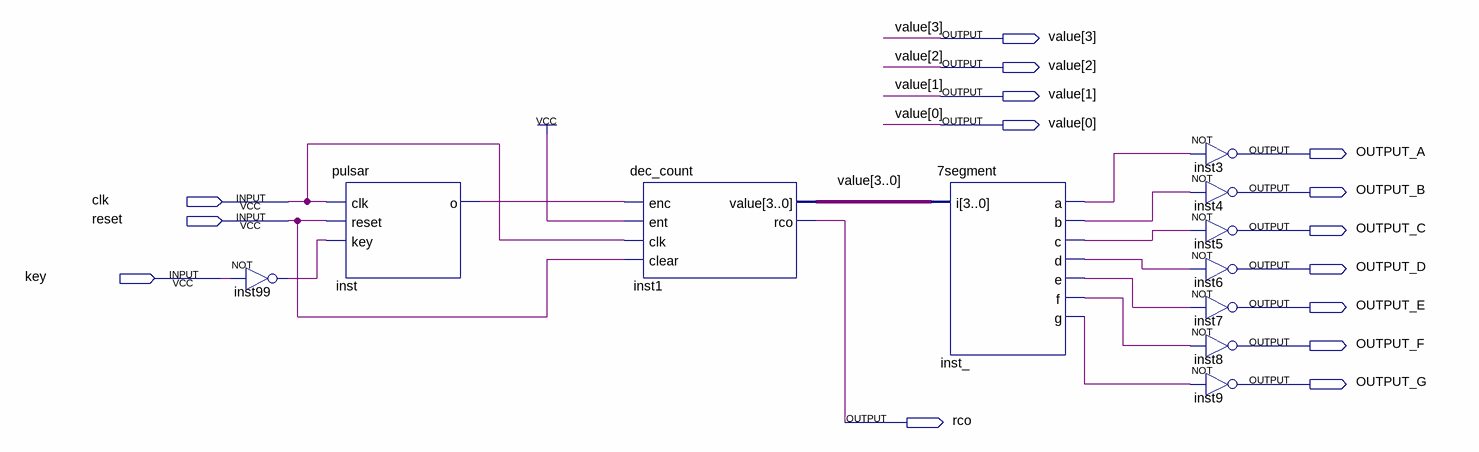
[diagram p0: schematic sheet]
// Quartus schematic YL_pushcounter.bdf as structural Verilog: 11 symbols, 15 pins
module YL_pushcounter (
  input  clk,
  input  reset,
  input  key,
  output [3:0] value,
  output OUTPUT_A,
  output OUTPUT_B,
  output OUTPUT_C,
  output OUTPUT_D,
  output OUTPUT_E,
  output OUTPUT_F,
  output OUTPUT_G,
  output rco
);

  wire inst99_out, inst__a, inst__b, inst__c, inst__d, inst__e, inst__f, inst__g, inst_o;

  not inst99 (inst99_out, key);
  pulsar inst (.clk(clk), .reset(reset), .key(inst99_out), .o(inst_o));
  dec_count inst1 (.enc(inst_o), .ent(1'b1), .clk(clk), .clear(reset), .value(value), .rco(rco));
  \7segment  inst_ (
    .i(value), .a(inst__a), .b(inst__b), .c(inst__c), .d(inst__d), .e(inst__e), .f(inst__f), .g(inst__g));
  not inst3 (OUTPUT_A, inst__a);
  not inst4 (OUTPUT_B, inst__b);
  not inst5 (OUTPUT_C, inst__c);
  not inst6 (OUTPUT_D, inst__d);
  not inst7 (OUTPUT_E, inst__e);
  not inst8 (OUTPUT_F, inst__f);
  not inst9 (OUTPUT_G, inst__g);
endmodule
